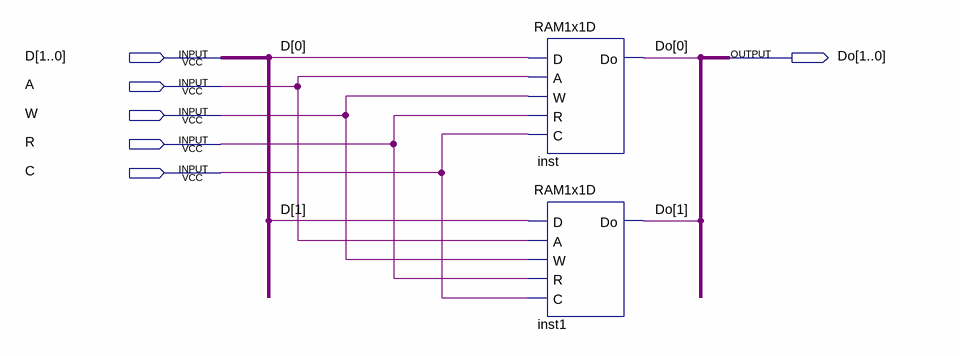
[diagram p0: schematic sheet]
// Quartus schematic RAM1x2.bdf as structural Verilog: 2 symbols, 6 pins
module RAM1x2 (
  input  [1:0] D,
  input  A,
  input  W,
  input  R,
  input  C,
  output [1:0] Do
);

  RAM1x1D inst (.D(D[0]), .A(A), .W(W), .R(R), .C(C), .Do(Do[0]));
  RAM1x1D inst1 (.D(D[1]), .A(A), .W(W), .R(R), .C(C), .Do(Do[1]));
endmodule
